# EAGLE design Plakat (EAGLE 7.6.0)
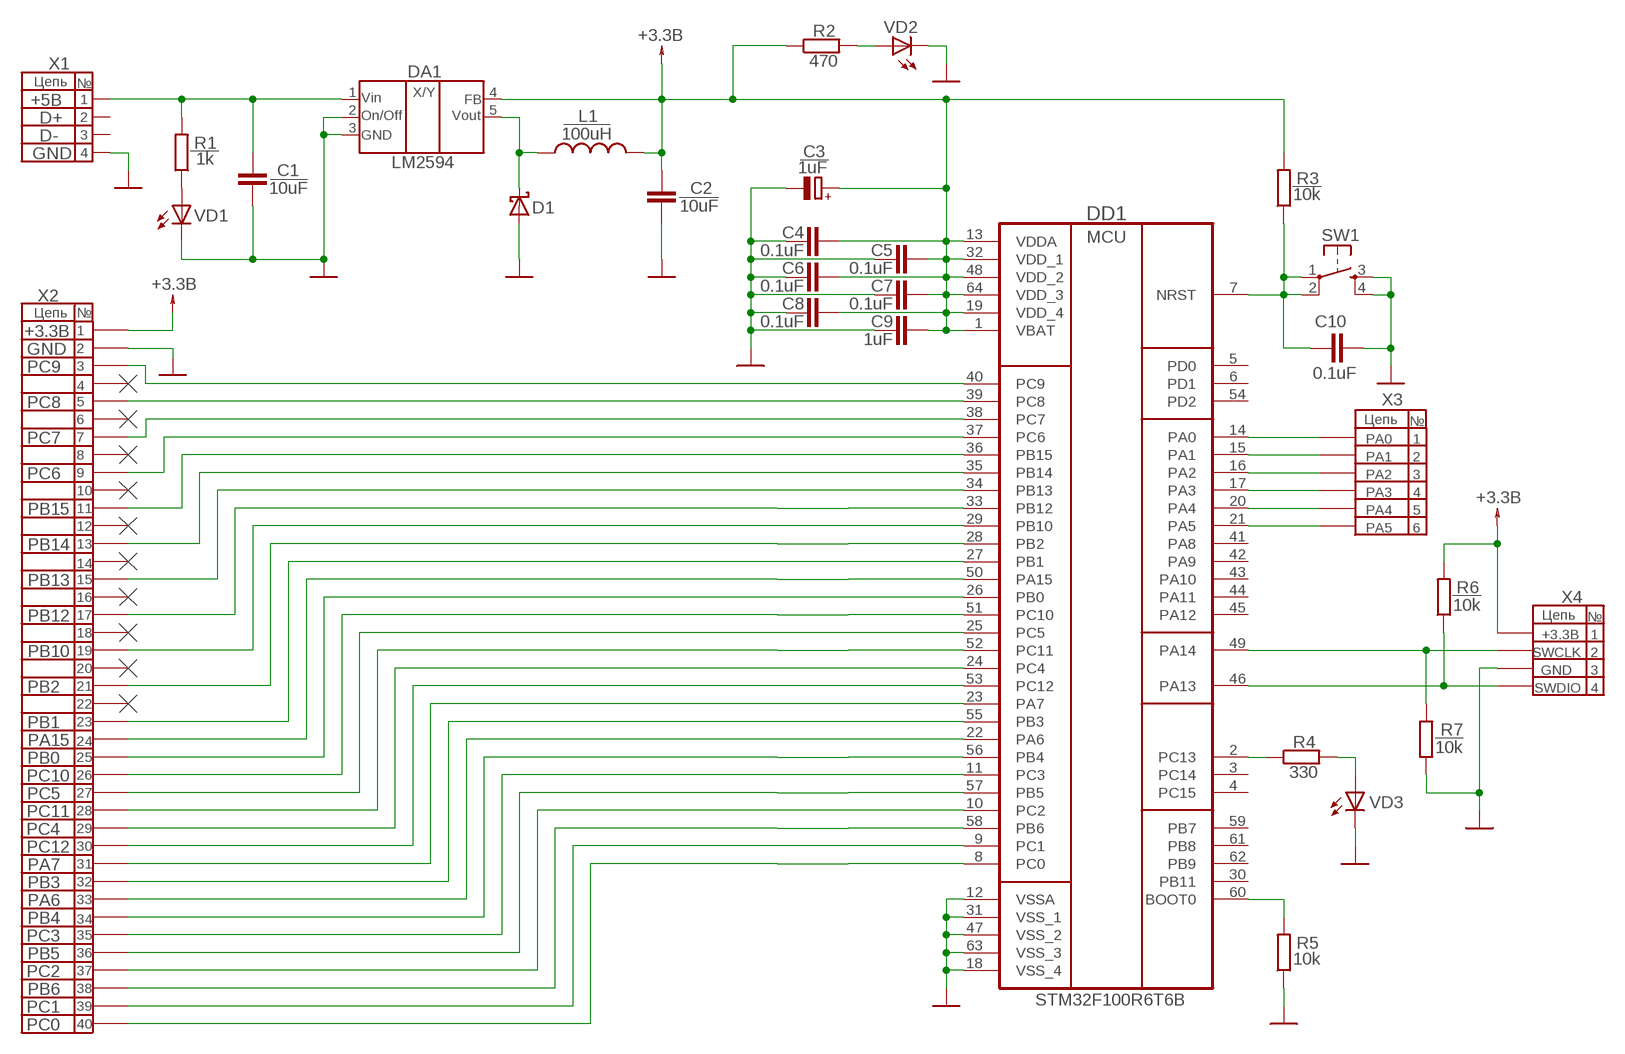
[diagram p0: schematic, sheet 1]

## Parts
C1  10uF  C-EUC0805  [C0805]
C2  10uF  C-EUC0805  [C0805]
C3  1uF  CPOL-EU  [TYPE_A_TECAP]
C4  0.1uF  C-EUC0805  [C0805]
C5  0.1uF  C-EUC0805  [C0805]
C6  0.1uF  C-EUC0805  [C0805]
C7  0.1uF  C-EUC0805  [C0805]
C8  0.1uF  C-EUC0805  [C0805]
C9  1uF  C-EUC0805  [C0805]
C10  0.1uF  C-EUC0805  [C0805]
D1  1N5819-T  [DO41-7.6]
DA1  LM2594  [LM2495]
DD1  STM32F100R6T6B  [QFP50P1200X1200X160-64N]
L1  100uH  SRD0604-101KL  [101KL]
R1  1k  R  [R0805]
R2  470  R  [R0805]
R3  10k  R  [R0805]
R4  330  R  [R0805]
R5  10k  R  [R0805]
R6  10k  R  [R0805]
R7  10k  R  [R0805]
SW1  DTSM-6  [DTSM-6]
VD1  LED_E  [LED_1206]
VD2  LED_E  [LED_1206]
VD3  LED_E  [LED_1206]
X1  USB-MICROB  [USB-MICROB]
X2  PINHD-2X20  [2X20]
X3  PINHD-1X6  [1X06]
X4  PINHD-1X4  [1X04]

## Nets
5V: C1.1 DA1.V(IN) R1.2 X1.VBUS
GND: C1.2 C2.2 C3.- C4.1 C5.1 C6.1 C7.1 C8.1 C9.1 C10.2 D1.A DA1.GND DA1.ON/OFF DD1.12(VSSA) DD1.18(VSS_4) DD1.31(VSS_1) DD1.47(VSS_2) DD1.63(VSS_3) R5.1 R7.1 SW1.3 SW1.4 VD1.C VD2.C VD3.C X1.GND X1.MT1(GND) X1.MT2(GND) X2.2 X4.3
N$1: DD1.60(BOOT0) R5.2
N$2: D1.C DA1.OUT L1.2
N$3: DD1.14(PA0) X3.1
N$4: R1.1 VD1.A
N$5: R4.2 VD3.A
N$6: DD1.15(PA1) X3.2
N$7: DD1.2(PC13) R4.1
N$8: DD1.16(PA2) X3.3
N$9: DD1.17(PA3) X3.4
N$10: DD1.20(PA4) X3.5
N$11: DD1.21(PA5) X3.6
N$14: R2.2 VD2.A
N$27: DD1.53(PC12) X2.30
N$30: C10.1 DD1.7(NRST) R3.1 SW1.1 SW1.2
N$39: DD1.40(PC9) X2.3
N$40: DD1.39(PC8) X2.5
N$41: DD1.38(PC7) X2.7
N$42: DD1.37(PC6) X2.9
N$43: DD1.36(PB15) X2.11
N$44: DD1.35(PB14) X2.13
N$45: DD1.34(PB13) X2.15
N$46: DD1.33(PB12) X2.17
N$47: DD1.29(PB10) X2.19
N$48: DD1.28(PB2) X2.21
N$49: DD1.27(PB1) X2.23
N$50: DD1.50(PA15) X2.24
N$51: DD1.26(PB0) X2.25
N$52: DD1.51(PC10) X2.26
N$53: DD1.25(PC5) X2.27
N$54: DD1.52(PC11) X2.28
N$55: DD1.24(PC4) X2.29
N$57: DD1.23(PA7) X2.31
N$58: DD1.55(PB3) X2.32
N$59: DD1.22(PA6) X2.33
N$60: DD1.56(PB4) X2.34
N$61: DD1.11(PC3) X2.35
N$62: DD1.57(PB5) X2.36
N$63: DD1.10(PC2) X2.37
N$64: DD1.58(PB6) X2.38
N$65: DD1.9(PC1) X2.39
N$66: DD1.8(PC0) X2.40
SWCLK: DD1.49(PA14) R7.2 X4.2
SWDIO: DD1.46(PA13) R6.1 X4.4
VCC: C2.1 C3.+ C4.2 C5.2 C6.2 C7.2 C8.2 C9.2 DA1.FB DD1.1(VBAT) DD1.13(VDDA) DD1.19(VDD_4) DD1.32(VDD_1) DD1.48(VDD_2) DD1.64(VDD_3) L1.1 R2.1 R3.2 R6.2 X2.1 X4.1 ; supply symbol labelled +3.3В
Unconnected: DD1.3(PC14) DD1.4(PC15) DD1.5(PD0) DD1.6(PD1) DD1.30(PB11) DD1.41(PA8) DD1.42(PA9) DD1.43(PA10) DD1.44(PA11) DD1.45(PA12) DD1.54(PD2) DD1.59(PB7) DD1.61(PB8) DD1.62(PB9) X1.D+ X1.D- X2.4 X2.6 X2.8 X2.10 X2.12 X2.14 X2.16 X2.18 X2.20 X2.22

## Notes on the sheet
- Цепь | №
- 1 | 4
- +5B | 1 | Vin | FB
- 2 | 5
- D+ | 2 | On/Off | Vout
- 3
- D- | 3 | GND
- GND | 4
- MCU
- +3.3B
- GND
- PC9
- PC8
- Цепь | №
- PC7 | PA0 | 1
- PA1 | 2
- PC6 | PA2 | 3
- PA3 | 4
- PB15 | PA4 | 5
- PA5 | 6
- PB14
- PB13
- PB12 | Цепь | №
- +3.3В | 1
- PB10 | SWCLK | 2
- GND | 3
- PB2 | SWDIO | 4
- PB1
- PA15
- PB0
- PC10
- PC5
- PC11
- PC4
- PC12
- PA7
- PB3
- PA6
- PB4
- PC3
- PB5
- PC2
- PB6
- STM32F100R6T6B
- PC1
- PC0

## Library data of the parts
C1 C2 C4-C10 = rcl:C-EU: CAPACITOR, European symbol
C3 = rcl:CPOL-EU: POLARIZED CAPACITOR, European symbol
D1 = diode:1N581*: 1.0A SCHOTTKY BARRIER RECTIFIER Source: http://www.diodes.com/datasheets/ds23001.pdf
DA1 = LM2594:LM2594
DD1 = ST Microelctronics_By_element14_Batch_1:STM32F100R6T6B: ARM-based 32-bit MCU; MPN: STM32F100R6T6B; OC_FARNELL: 1838506; OC_NEWARK: 76R0991; PACKAGE: QFP-64; SUPPLIER: STMICROELECTRONICS
L1 = BOURNS:SRD0604-101KL
R1-R7 = eagle-ltspice:R: RESISTOR, European symbol; SPICEMODEL: NONE; SPICEPREFIX: R
SW1 = switch-tact:DTSM-6
VD1-VD3 = eagle-ltspice:LED_E: LED Source: http://www.osram.convergy.de Source: www.luxeon.com Source: www.kingbright.com; SPICEMODEL: NONE; SPICEPREFIX: D; SPICETYPE: diode
X1 = SparkFun-Connectors:USB: USB Connectors USB-B-PTH is fully proven SKU : PRT-00139/CONN-08278 USB-miniB is fully proven SKU : PRT-00587 USB-A-PCB is untested. USB-A-H is throughly reviewed, but untested. Spark Fun Electronics SKU : PRT-00437 USB-B-SMT is throughly reviewed, but untested. Needs silkscreen touching up. USB-A-S has not been used/tested USB-MB-H has not been used/tested USB-MICROB has been used. CONN-09505; PROD_ID: CONN-09505
X2 = pinhead:PINHD-2X20: PIN HEADER
X3 = pinhead:PINHD-1X6: PIN HEADER
X4 = pinhead:PINHD-1X4: PIN HEADER

## Board
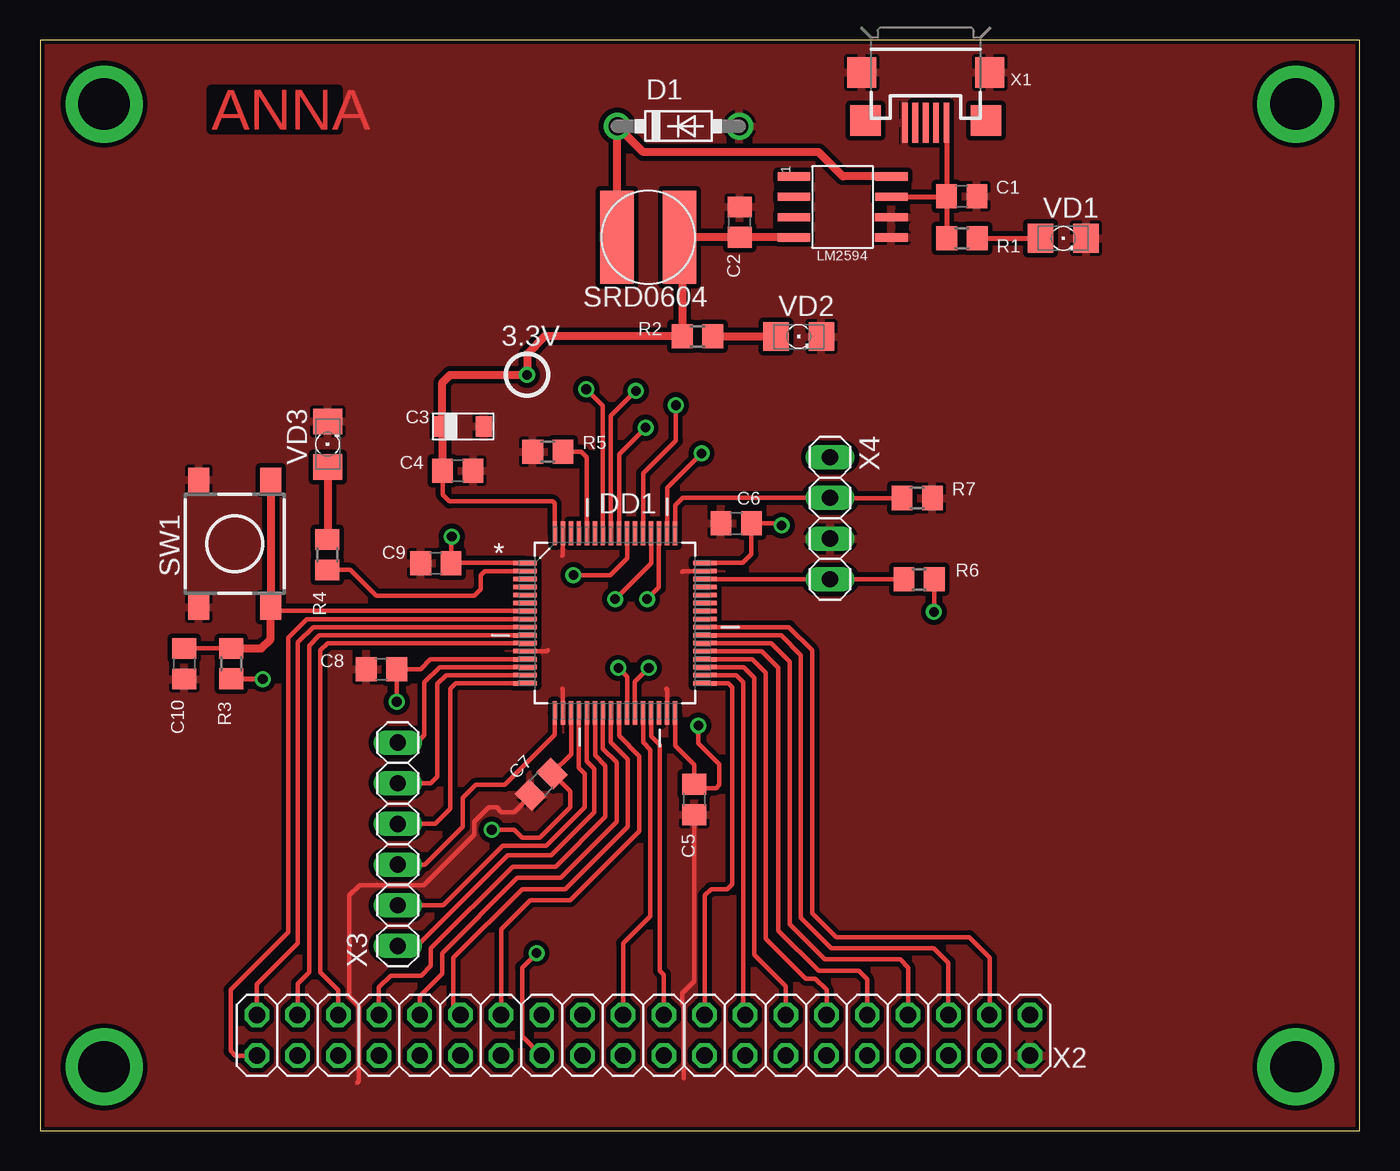
[diagram p1: board, top side]
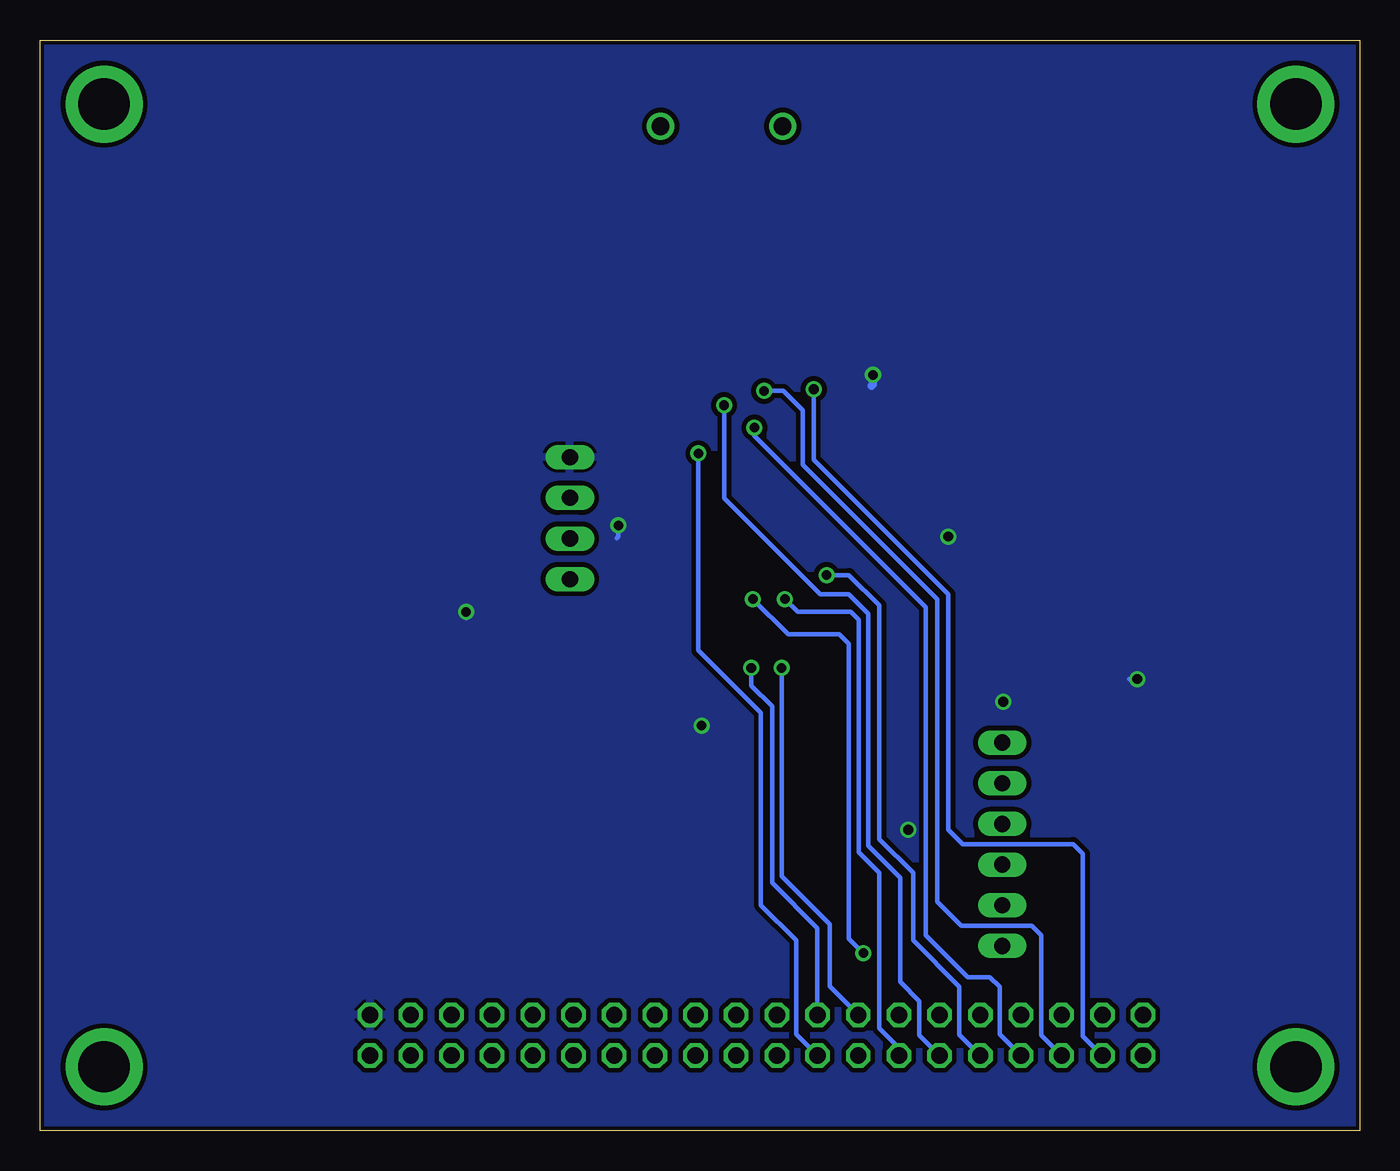
[diagram p2: board, bottom side, seen from below]

Size 82.4 x 68.1 mm. Coordinates in mm from the lower left corner, seen from the top.
Outline: 0,0 82.4,0 82.4,68.1 0,68.1 0,0
Copper layers (1*16): Top 0.105mm / dielectric 1.55mm / Bottom 0.105mm
Design rules "eC_2Layer_PClass3_BaseCopperO105": minimum track width 0.25mm, minimum drill 0.35mm, track to track 0.3mm, track to pad 0.3mm, pad to pad 0.3mm, via to via 0.3mm, smd to smd 0mil, copper to edge 0.25mm, drill to drill 0.35mm, minimum pad ring 0.25mm, minimum via ring 0.2mm, stop-mask expansion 0mil, vias tented up to drill 0.45mm, thermal gap 0.2mm

### Footprints (pad centres in the part's own frame; a part is rotated, then mirrored left to right if it is on the bottom)
C0805 = smd 1.3 x 1.5: 1 -0.95,0; 2 0.95,0
TYPE_A_TECAP = smd 1 x 1.27: + 2.9,0.6; - 0.3,0.6
DO41-7.6 = drill 1.1 pad 1.7: A 3.81,0; C -3.81,0
LM2495 = smd 0.51 x 2.032: FB 1.905,-3.035; GND 0.635,3.035; ON/OFF 1.905,3.035; OUT -1.905,3.035; P$5 -0.635,-3.035; P$6 -1.905,-3.035; P$8 0.635,-3.035; V(IN) -0.635,3.035
QFP50P1200X1200X160-64N = smd 1.473 x 0.279: 1 -5.613,3.759; 2 -5.613,3.251; 3 -5.613,2.743; 4 -5.613,2.261; 5 -5.613,1.753; 6 -5.613,1.245; 7 -5.613,0.762; 8 -5.613,0.254; 9 -5.613,-0.254; 10 -5.613,-0.762; 11 -5.613,-1.245; 12 -5.613,-1.753; 13 -5.613,-2.261; 14 -5.613,-2.743; 15 -5.613,-3.251; 16 -5.613,-3.759; 33 5.613,-3.759; 34 5.613,-3.251; 35 5.613,-2.743; 36 5.613,-2.261; 37 5.613,-1.753; 38 5.613,-1.245; 39 5.613,-0.762; 40 5.613,-0.254; 41 5.613,0.254; 42 5.613,0.762; 43 5.613,1.245; 44 5.613,1.753; 45 5.613,2.261; 46 5.613,2.743; 47 5.613,3.251; 48 5.613,3.759 | smd 0.279 x 1.473: 17 -3.759,-5.613; 18 -3.251,-5.613; 19 -2.743,-5.613; 20 -2.261,-5.613; 21 -1.753,-5.613; 22 -1.245,-5.613; 23 -0.762,-5.613; 24 -0.254,-5.613; 25 0.254,-5.613; 26 0.762,-5.613; 27 1.245,-5.613; 28 1.753,-5.613; 29 2.261,-5.613; 30 2.743,-5.613; 31 3.251,-5.613; 32 3.759,-5.613; 49 3.759,5.613; 50 3.251,5.613; 51 2.743,5.613; 52 2.261,5.613; 53 1.753,5.613; 54 1.245,5.613; 55 0.762,5.613; 56 0.254,5.613; 57 -0.254,5.613; 58 -0.762,5.613; 59 -1.245,5.613; 60 -1.753,5.613; 61 -2.261,5.613; 62 -2.743,5.613; 63 -3.251,5.613; 64 -3.759,5.613
101KL = smd 2.1 x 5.8: 1 -1.95,0; 2 1.95,0
R0805 = smd 1.3 x 1.5: 1 -0.95,0; 2 0.95,0
DTSM-6 = smd 1.55 x 1.3: 1 -3.975,2.25; 2 3.975,2.25; 3 -3.975,-2.25; 4 3.975,-2.25
LED_1206 = smd 1.6 x 1.803: A -1.422,0; C 1.422,0
USB-MICROB = smd 0.35 x 2.5: D+ 0,3.15; D- -0.65,3.15; GND 1.3,3.15; ID 0.65,3.15; VBUS -1.3,3.15 | smd 1.8 x 1.9: MT1 -4,0; MT2 4,0 | smd 1.9 x 1.9: P$1 -3.77,3; P$2 3.77,3
2X20 = drill 1.016 octagon: 1 -24.13,-1.27; 2 -24.13,1.27; 3 -21.59,-1.27; 4 -21.59,1.27; 5 -19.05,-1.27; 6 -19.05,1.27; 7 -16.51,-1.27; 8 -16.51,1.27; 9 -13.97,-1.27; 10 -13.97,1.27; 11 -11.43,-1.27; 12 -11.43,1.27; 13 -8.89,-1.27; 14 -8.89,1.27; 15 -6.35,-1.27; 16 -6.35,1.27; 17 -3.81,-1.27; 18 -3.81,1.27; 19 -1.27,-1.27; 20 -1.27,1.27; 21 1.27,-1.27; 22 1.27,1.27; 23 3.81,-1.27; 24 3.81,1.27; 25 6.35,-1.27; 26 6.35,1.27; 27 8.89,-1.27; 28 8.89,1.27; 29 11.43,-1.27; 30 11.43,1.27; 31 13.97,-1.27; 32 13.97,1.27; 33 16.51,-1.27; 34 16.51,1.27; 35 19.05,-1.27; 36 19.05,1.27; 37 21.59,-1.27; 38 21.59,1.27; 39 24.13,-1.27; 40 24.13,1.27
1X06 = drill 1.016 long: 1 -6.35,0; 2 -3.81,0; 3 -1.27,0; 4 1.27,0; 5 3.81,0; 6 6.35,0
1X04 = drill 1.016 long: 1 -3.81,0; 2 -1.27,0; 3 1.27,0; 4 3.81,0

### Placement (x,y rotation side)
C1  57.54,58.34 0 top
C2  43.67,56.73 90 top
C3  28.01,44.58 180 top
C4  26.08,41.21 180 top
C5  40.85,20.69 90 top
C6  43.46,37.92 0 top
C7  31.28,21.64 45 top
C8  21.31,28.83 0 top
C9  24.71,35.44 0 top
C10  9,29.16 270 top
D1  39.85,62.72 0 top
DA1  50.11,57.68 270 top
DD1  35.89,31.7 0 top
L1  37.97,55.8 180 top
R1  57.55,55.73 180 top
R2  41.04,49.6 0 top
R3  11.94,29.17 270 top
R4  17.93,35.97 90 top
R5  31.7,42.4 0 top
R6  54.88,34.43 0 top
R7  54.76,39.51 180 top
SW1  12.15,36.66 270 top
VD1  63.88,55.72 0 top
VD2  47.36,49.59 0 top
VD3  17.95,42.87 90 top
X1  55.29,66.08 180 top
X2  37.67,5.97 180 top
X3  22.33,17.89 270 top
X4  49.32,38.25 270 top

### Tracks (layer width: path | path; a pad name or v marks a point on that pad's centre or on a via)
5V
  Top 0.305: X1.VBUS C1.1 | DA1.V(IN) 56.56,58.31 C1.1 | C1.1 R1.2
GND
  Top 0.28: DD1.12 31.64,29.95 31.7,30 | DD1.18 32.64,27.56 32.6,27.6 | DD1.31 39.14,27.56 39.1,27.6 | DD1.47 40.15,34.95 40.1,34.9 | DD1.63 32.64,35.94 32.6,35.9 | 19.8,3 19.9,3.1 19.9,7.8 19.3,8.4 19.3,14.7 19.95,15.35 21.01,15.35 21.02,15.36 21.03,15.35 23.95,15.35 27.1,18.5 27.1,19.3 28,20.2 28.5,20.2 28.8,19.9 29.6,19.9 30.61,20.91 C7.1 | C5.1 40.85,9.35 40.1,8.6 40.1,8 40.2,7.9 40.2,3.3
  pour Top: -3.5,-5.4 88.4,-5.4 88.4,74.9 -3.5,74.9
N$1
  Top 0.28: DD1.60 34.14,42.06 33.8,42.4 R5.2
N$2
  Top 0.5: DA1.OUT 50.12,59.59 48.6,61.1 37.66,61.1 D1.C 36.02,62.7 L1.2
N$3
  Top 0.28: DD1.14 24.95,28.95 24,28 24,24.7 23.54,24.24 X3.1
N$4
  Top 0.305: R1.1 62.45,55.73 VD1.A
N$5
  Top 0.5: VD3.A 17.95,36.94 R4.2
N$6
  Top 0.28: DD1.15 25.35,28.45 24.8,27.9 24.8,22.1 24.4,21.7 X3.2
N$7
  Top 0.28: DD1.2 27.75,34.95 27.5,34.7 27.5,33.8 27.1,33.4 21,33.4 19.38,35.02 R4.1
N$8
  Top 0.28: DD1.16 25.94,27.94 25.6,27.6 25.6,20.1 24.66,19.16 X3.3
N$9
  Top 0.28: DD1.17 32.13,24.73 29,21.6 27.2,21.6 26.4,20.8 26.4,19 24.02,16.62 X3.4
N$10
  Top 0.28: DD1.20 33.63,22.67 34,22.3 34,20.2 31.6,17.8 28.9,17.8 25.18,14.08 X3.5
N$11
  Top 0.28: DD1.21 34.14,23.06 34.6,22.6 34.6,19.9 31.9,17.2 29.2,17.2 23.54,11.54 X3.6
N$13  (via drill 3.2 pad 4.5)
  other vias: 4,4
N$14
  Top 0.5: R2.2 45.93,49.6 VD2.A
N$15  (via drill 3.2 pad 4.5)
  other vias: 4,64.1
N$16  (via drill 3.2 pad 4.5)
  other vias: 78.4,64.1
N$17  (via drill 3.2 pad 4.5)
  other vias: 78.4,4
N$27  (via drill 0.6)
  Top 0.28: DD1.53 37.64,41.04 39.7,43.1 v39.7,45.3
  Bottom 0.28: v39.7,45.3 39.7,39.5 33.7,33.5 31.9,33.5 30.7,32.3 30.7,21.2 30.7,20.8 30.7,17.8 28.7,15.8 28.7,9.3 27.5,8.1 27.5,5.96 X2.30
N$30
  Top 0.28: DD1.7 14.62,32.46 SW1.2 | R3.1 C10.1
  Top 0.5: SW1.1 SW1.2 14.4,30.7 13.82,30.12 R3.1
N$39
  Top 0.28: DD1.40 46.76,31.44 48.2,30 48.2,13.6 49.7,12.1 58,12.1 59.3,10.8 59.3,7.28 X2.3
N$40
  Top 0.28: DD1.39 46.26,30.94 47.5,29.7 47.5,13.3 49.4,11.4 55.8,11.4 56.7,10.5 56.7,7.26 X2.5
N$41
  Top 0.28: DD1.38 45.65,30.45 46.8,29.3 46.8,12.9 49,10.7 53.7,10.7 54.2,10.2 54.2,7.26 X2.7
N$42
  Top 0.28: DD1.37 45.05,29.95 46.1,28.9 46.1,12.5 48.6,10 51.1,10 51.64,9.46 X2.9
N$43
  Top 0.28: DD1.36 44.46,29.44 45.3,28.6 45.3,12 47.8,9.5 48.4,9.5 49.1,8.8 X2.11
N$44
  Top 0.28: DD1.35 43.95,28.95 44.6,28.3 44.6,11 46.56,9.04 X2.13
N$45
  Top 0.28: DD1.34 43.45,28.45 43.9,28 43.9,7.36 X2.15
N$46
  Top 0.28: DD1.33 42.96,27.94 43.2,27.7 43.2,15.4 42.9,15.1 41.9,15.1 41.5,14.7 41.5,7.26 X2.17
N$47
  Top 0.28: DD1.29 38.15,24.65 38.7,24.1 38.7,10.01 38.95,9.76 X2.19
N$48
  Top 0.28: DD1.28 37.64,24.26 38.1,23.8 38.1,13.4 36.4,11.7 X2.21
N$49  (via drill 0.6)
  Top 0.28: DD1.27 37.13,28.04 v38,28.9
  Bottom 0.28: v38,28.9 38,27.8 36.7,26.5 36.7,15.48 33.87,12.65 X2.23
N$50  (via drill 0.6)
  Top 0.28: DD1.50 39.14,40.14 v41.3,42.3
  Bottom 0.28: v41.3,42.3 41.3,30 37.4,26.1 37.4,14.1 35.2,11.9 35.2,6.04 X2.24
N$51  (via drill 0.6)
  Top 0.28: DD1.26 36.65,28.35 v36.1,28.9
  Bottom 0.28: v36.1,28.9 36.1,15.9 33.1,12.9 33.1,9.02 X2.25 31.3,7.26
N$52  (via drill 0.6)
  Top 0.28: DD1.51 38.63,33.93 v37.9,33.2 | v31,11.1 30.1,10.2 30.1,5.9 31.3,4.7 X2.26
  Bottom 0.28: v31,11.1 31.9,12 31.9,30.4 32.5,31 35.7,31 v37.9,33.2
N$53
  Top 0.28: DD1.25 36.15,24.66 37.4,23.4 37.4,18.7 33.1,14.4 30.6,14.4 28.8,12.6 28.8,7.26 X2.27
N$54  (via drill 0.6)
  Top 0.28: DD1.52 38.15,35.45 v35.9,33.2
  Bottom 0.28: v35.9,33.2 35.1,32.4 31.8,32.4 31.3,31.9 31.3,17.4 30,16.1 30,6.4 28.78,5.18 X2.28
N$55
  Top 0.28: DD1.24 35.64,24.26 36.7,23.2 36.7,19 32.8,15.1 30.1,15.1 25.8,10.8 25.8,7.68 X2.29
N$57
  Top 0.28: DD1.23 35.13,23.87 36,23 36,19.3 32.5,15.8 29.8,15.8 25.1,11.1 25.1,9.8 23.7,8.4 X2.31
N$58  (via drill 0.6)
  Top 0.28: DD1.55 36.65,35.75 35.6,34.7 v33.3,34.7
  Bottom 0.28: X2.32 25,6 25,9 27.9,11.9 27.9,16.1 30,18.2 30,32.8 31.9,34.7 v33.3,34.7
N$59
  Top 0.28: DD1.22 34.65,23.45 35.3,22.8 35.3,19.6 32.2,16.5 29.5,16.5 24.4,11.4 24.4,10.3 23.8,9.7 21.9,9.7 21.16,8.96 X2.33
N$60  (via drill 0.6)
  Top 0.28: DD1.56 36.15,42.24 v37.8,43.9
  Bottom 0.28: v37.8,43.9 37.8,43.4 27.1,32.7 27.1,12.2 24.5,9.6 23.1,9.6 22.5,9 22.5,6.04 X2.34
N$61
  Top 0.28: DD1.11 17.95,30.45 17.5,30 17.5,9.9 18.62,8.78 X2.35
N$62  (via drill 0.6)
  Top 0.28: DD1.57 35.64,44.64 v37.2,46.2
  Bottom 0.28: v37.2,46.2 36,46.2 34.8,45 34.8,41.6 26.4,33.2 26.4,14.3 24.9,12.8 20.5,12.8 19.9,12.2 19.9,5.98 X2.36
N$63
  Top 0.28: DD1.10 17.44,30.94 16.8,30.3 16.8,9.9 16.1,9.2 16.1,7.26 X2.37
N$64  (via drill 0.6)
  Top 0.28: DD1.58 35.13,45.27 v34.1,46.3
  Bottom 0.28: X2.38 17.3,5.92 17.3,17.3 17.9,17.9 24.8,17.9 25.7,18.8 25.7,33.5 34.1,41.9 v34.1,46.3
N$65
  Top 0.28: DD1.9 17.04,31.44 16.1,30.5 16.1,11.7 13.54,9.14 X2.39
N$66
  Top 0.28: DD1.8 16.65,31.95 15.5,30.8 15.5,12.4 11.9,8.8 11.9,5 12.2,4.7 X2.40
SWCLK
  Top 0.28: DD1.49 39.65,39.05 40.12,39.52 X4.2 R7.2
SWDIO
  Top 0.28: DD1.46 X4.4 R6.1
VCC  (via drill 0.6)
  Top 0.28: DD1.1 25.68,35.46 C9.2 25.66,37.06 v25.7,37.1 | DD1.48 43.86,35.46 44.4,36 C6.2 46.18,37.92 v46.3,37.8 | DD1.13 24.37,29.44 23.76,28.83 C8.2 v22.27,26.79 | DD1.19 33.15,23.5 C7.2 31.99,22.31 33.1,21.2 33.1,20.2 31.2,18.3 30.1,18.3 29.6,18.8 v28.2,18.8 | DD1.32 39.65,24.05 40.85,22.85 C5.2 41.09,21.4 42.2,21.4 42.4,21.6 42.4,22.9 41.1,24.2 v41.1,25.3 | DD1.64 32.13,39.17 32,39.3 25.55,39.3 25.15,39.7 25.15,41.19 C4.2 25.11,41.23 | R6.2 55.83,32.43 v55.8,32.4
  Top 0.305: R3.2 13.88,28.22 v13.9,28.2
  Top 0.5: DA1.FB C2.1 39.94,55.78 L1.1 | 39.9,55.78 L1.1 | L1.1 40.09,55.63 R2.1 31.5,49.6 30.4,48.5 v30.4,47.2 | v30.41,47.19 v30.4,47.2 | v30.4,47.2 25.6,47.2 25.11,46.71 C3.+ 25.15,43.94 25.15,41.19
  Bottom 0.28: v25.7,37.1 25.9,37.3 | v46.3,37.8 46.3,37.1 46.4,37 | v55.8,32.4 55.8,32
  Bottom 0.305: v13.9,28.2 14.4,28.2
  Bottom 0.5: v30.4,47.2 30.4,46.6 30.5,46.5
  pour Bottom: 0,0 82.4,0 82.4,68.1 0,68.1

### Text on the board
Top: ANNA
tNames: 3.3V